# EAGLE design Arduino thermcouple (EAGLE 7.2.0)
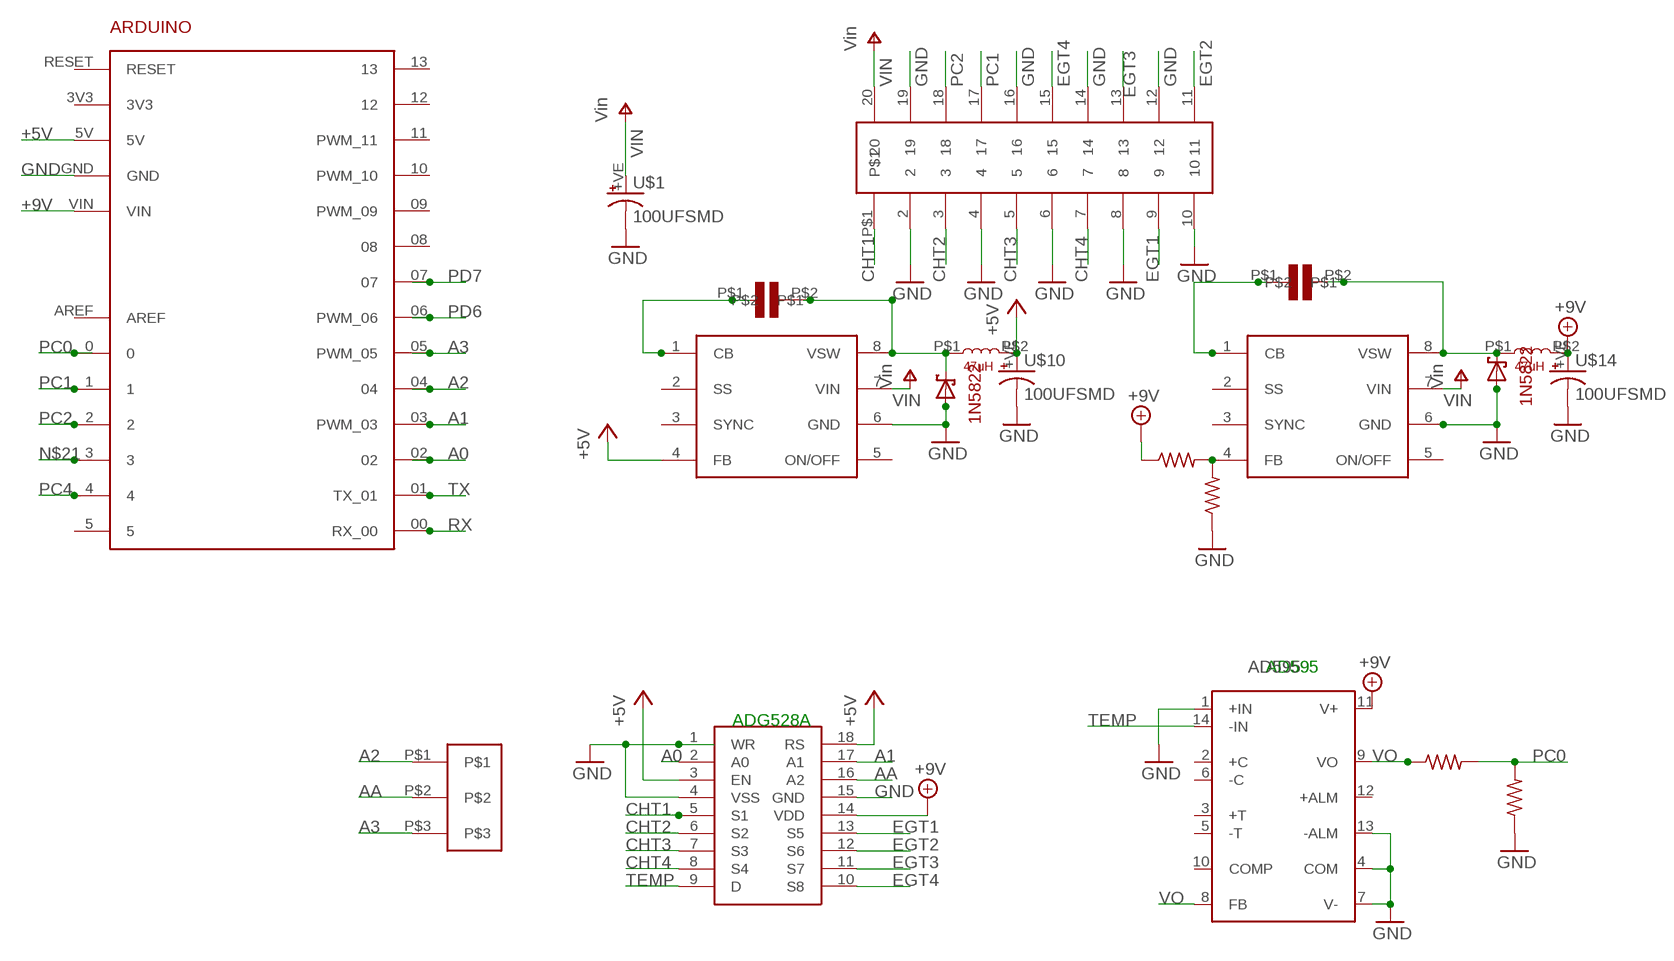
[diagram p0: schematic, sheet 1]

## Parts
"  ADG528A  [DIL18]
ARDUINO2  ARDUINO  [ARDUINO]
IC2  AD595  [DIL14]
R5  10K  0.3RESISTOR  [0.3RESISTOR]
R6  10K  0.3RESISTOR  [0.3RESISTOR]
U$1  100UFSMD  [100UFSMD]
U$2  1N5822  [1N5822]
U$3  LM2672  [DIL08]
U$4  1N5822  [1N5822]
U$5  01CAP  [01CAP]
U$6  LM2672  [DIL08]
U$7  01CAP  [01CAP]
U$8  20PIN0.1INCH  [20PIN0.1INCH]
U$9  47uH  47UHSMD  [47UHSMD]
U$10  100UFSMD  [100UFSMD]
U$13  47uH  47UHSMD  [47UHSMD]
U$14  100UFSMD  [100UFSMD]
U$15  1K5  0.3RESISTOR  [0.3RESISTOR]
U$16  10K  0.3RESISTOR  [0.3RESISTOR]
U$17  3PINHEADER  [3PINHEADER]

## Nets
+5V: ".3(EN) ".18(RS) ARDUINO2.5V U$3.4(FB) U$9.P$2 U$10.+VE(+)
+9V: ".14(VDD) ARDUINO2.VIN IC2.11(V+) U$13.P$2 U$14.+VE(+) U$16.P$1
A0: ".2(A0) ARDUINO2.02
A1: ".17(A1) ARDUINO2.03(PWM_03)
A2: ARDUINO2.04 U$17.P$1
A3: ARDUINO2.05(PWM_05) U$17.P$3
AA: ".16(A2) U$17.P$2
CHT1: ".5(S1) U$8.P$1
CHT2: ".6(S2) U$8.3
CHT3: ".7(S3) U$8.5
CHT4: ".8(S4) U$8.7
EGT1: ".13(S5) U$8.9
EGT2: ".12(S6) U$8.11
EGT3: ".11(S7) U$8.13
EGT4: ".10(S8) U$8.15
GND: ".1(WR) ".4(VSS) ".15(GND) ARDUINO2.GND IC2.1(+IN) IC2.4(COM) IC2.7(V-) IC2.13(-ALM) R6.P$1 U$1.-VE(-) U$2.A U$3.6(GND) U$4.A U$6.6(GND) U$8.2 U$8.4 U$8.6 U$8.8 U$8.10 U$8.12 U$8.14 U$8.16 U$8.19 U$10.-VE(-) U$14.-VE(-) U$15.P$1
N$1: U$6.1(CB) U$7.P$1
N$2: U$3.1(CB) U$5.P$1
N$5: U$2.K(C) U$3.8(VSW) U$5.P$2 U$9.P$1
N$7: U$6.4(FB) U$15.P$2 U$16.P$2
N$21: ARDUINO2.3
N$24: U$4.K(C) U$6.8(VSW) U$7.P$2 U$13.P$1
PC0: ARDUINO2.0 R5.P$2 R6.P$2
PC1: ARDUINO2.1 U$8.17
PC2: ARDUINO2.2 U$8.18
PC4: ARDUINO2.4
PD6: ARDUINO2.06(PWM_06)
PD7: ARDUINO2.07
RX: ARDUINO2.00(RX_00)
TEMP: ".9(D) IC2.14(-IN)
TX: ARDUINO2.01(TX_01)
VIN: U$1.+VE(+) U$3.7(VIN) U$6.7(VIN) U$8.20 ; supply symbol labelled V+
VO: IC2.8(FB) IC2.9(VO) R5.P$1
Unconnected: ARDUINO2.3V3 ARDUINO2.5 ARDUINO2.08 ARDUINO2.09(PWM_09) ARDUINO2.10(PWM_10) ARDUINO2.11(PWM_11) ARDUINO2.12 ARDUINO2.13 ARDUINO2.AREF ARDUINO2.RESET IC2.2(+C) IC2.3(+T) IC2.5(-T) IC2.6(-C) IC2.10(COMP) IC2.12(+ALM) U$3.2(SS) U$3.3(SYNC) U$3.5(ON/OFF) U$6.2(SS) U$6.3(SYNC) U$6.5(ON/OFF)

## Notes on the sheet
- AD595
- ADG528A

## Library data of the parts
" = 1components:ADG528A
ARDUINO2 = 1components:ARDUINO: For creating Arduino shields
IC2 = 1components:AD595: ANALOG DEVICES; MPN: AD595AQ; OC_FARNELL: 409194; OC_NEWARK: 06WX1596
R5 R6 U$15 U$16 = 1resistors:0.3RESISTOR
U$1 U$10 U$14 = 1components:100UFSMD
U$2 U$4 = 1components:1N5822
U$3 U$6 = 1components:LM2672
U$5 U$7 = 1components:01CAP
U$8 = 20pin0.1inch:20PIN0.1INCH
U$9 U$13 = 1components:47UHSMD
U$17 = 1components:3PINHEADER

## Board
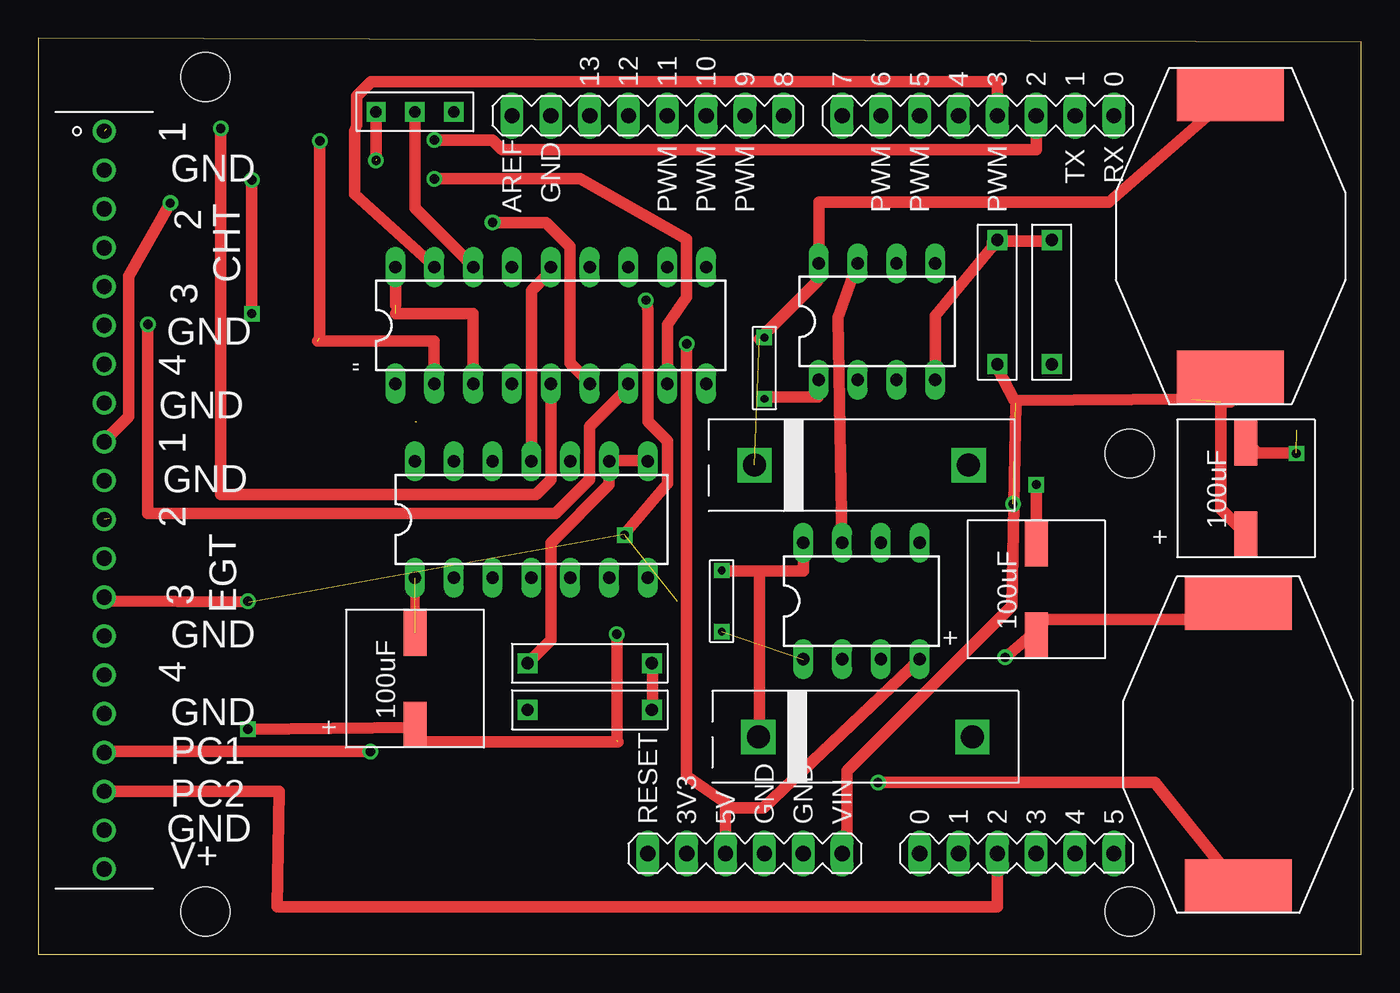
[diagram p1: board, top side]
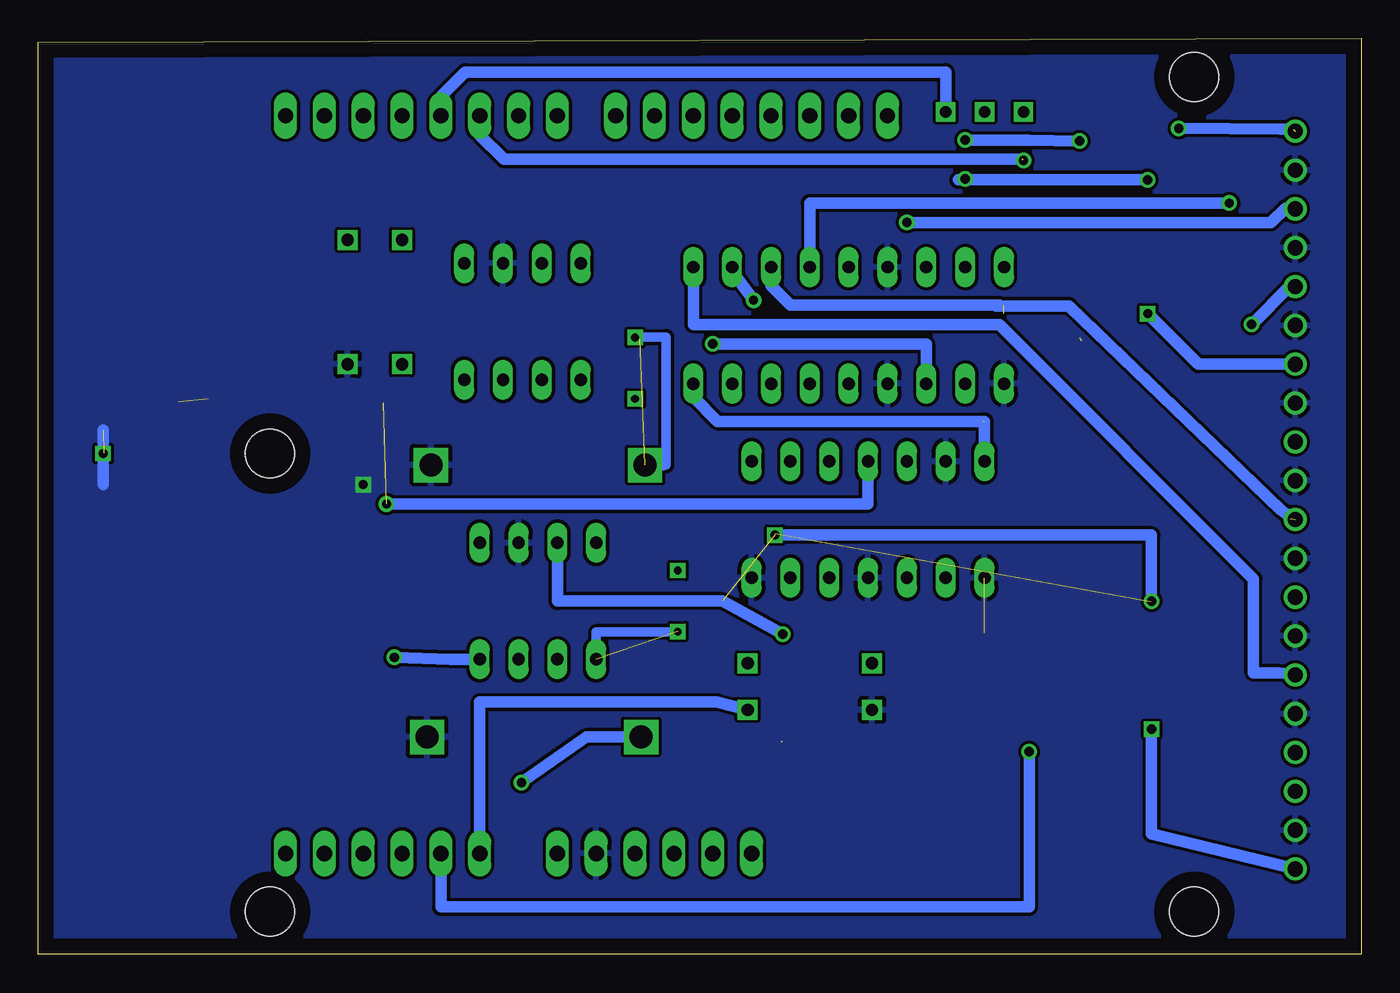
[diagram p2: board, bottom side, seen from below]

Size 86.54 x 59.93 mm. Coordinates in mm from the lower left corner, seen from the top.
Outline: 0,0 86.54,0 86.54,59.68 0,59.93 0,0
Copper layers (1*16): Top 0.035mm / dielectric 1.5mm / Bottom 0.035mm
Design rules "default *": minimum track width 30mil, minimum drill 24mil, track to track 8mil, track to pad 8mil, pad to pad 8mil, via to via 8mil, smd to smd 8mil, copper to edge 40mil, drill to drill 8mil, minimum pad ring 10mil, minimum via ring 8mil, stop-mask expansion 4mil, vias tented up to drill 0mil, thermal gap 10mil
Holes 3.2 mm at 10.92,57.4 10.92,2.79 71.37,2.79 71.37,32.77

### Footprints (pad centres in the part's own frame; a part is rotated, then mirrored left to right if it is on the bottom)
DIL18 = drill 0.813 long: 1 -10.16,-3.81; 2 -7.62,-3.81; 3 -5.08,-3.81; 4 -2.54,-3.81; 5 0,-3.81; 6 2.54,-3.81; 7 5.08,-3.81; 8 7.62,-3.81; 9 10.16,-3.81; 10 10.16,3.81; 11 7.62,3.81; 12 5.08,3.81; 13 2.54,3.81; 14 0,3.81; 15 -2.54,3.81; 16 -5.08,3.81; 17 -7.62,3.81; 18 -10.16,3.81
ARDUINO = drill 1 long: 00 25.4,-20.32; 0 -22.86,-7.62; 01 25.4,-17.78; 1 -22.86,-10.16; 02 25.4,-15.24; 2 -22.86,-12.7; 03 25.4,-12.7; 3 -22.86,-15.24; 3V3 -22.86,7.62; 04 25.4,-10.16; 4 -22.86,-17.78; 05 25.4,-7.62; 5 -22.86,-20.32; 5V -22.86,5.08; 06 25.4,-5.08; 07 25.4,-2.54; 08 25.4,1.27; 09 25.4,3.81; 10 25.4,6.35; 11 25.4,8.89; 12 25.4,11.43; 13 25.4,13.97; AREF 25.4,19.05; GND -22.86,0; GND2 -22.86,2.54; GND3 25.4,16.51; RESET -22.86,10.16; VIN -22.86,-2.54
DIL14 = drill 0.813 long: 1 -7.62,-3.81; 2 -5.08,-3.81; 3 -2.54,-3.81; 4 0,-3.81; 5 2.54,-3.81; 6 5.08,-3.81; 7 7.62,-3.81; 8 7.62,3.81; 9 5.08,3.81; 10 2.54,3.81; 11 0,3.81; 12 -2.54,3.81; 13 -5.08,3.81; 14 -7.62,3.81
0.3RESISTOR = drill 0.8 square: P$1 -4.064,0; P$2 4.064,0
100UFSMD = smd 1.5 x 3: +VE 0,3; -VE 0,-3
1N5822 = drill 1.5 square: A -7,0; K 7,0
DIL08 = drill 0.813 long: 1 -3.81,-3.81; 2 -1.27,-3.81; 3 1.27,-3.81; 4 3.81,-3.81; 5 3.81,3.81; 6 1.27,3.81; 7 -1.27,3.81; 8 -3.81,3.81
01CAP = drill 0.5 square: P$1 -2,0; P$2 2,0
20PIN0.1INCH = drill 1: 2 22.86,0; 3 20.32,0; 4 17.78,0; 5 15.24,0; 6 12.7,0; 7 10.16,0; 8 7.62,0; 9 5.08,0; 10 2.54,0; 11 0,0; 12 -2.54,0; 13 -5.08,0; 14 -7.62,0; 15 -10.16,0; 16 -12.7,0; 17 -15.24,0; 18 -17.78,0; 19 -20.32,0; 20 -22.86,0; P$1 25.4,0
47UHSMD = smd 3.5 x 7: P$1 -9.25,0; P$2 9.25,0
3PINHEADER = drill 0.75 square: P$1 -2.54,0; P$2 0,0; P$3 2.54,0

### Placement (x,y rotation side)
"  33.53,41.15 0 top
ARDUINO2  50.04,29.46 90 top
IC2  32.26,28.45 0 top
R5  36.07,19.05 0 top
R6  36.07,16 0 top
U$1  24.64,18.03 180 top
U$2  54.1,14.22 180 top
U$3  53.85,23.11 0 top
U$4  53.85,32 180 top
U$5  44.7,23.11 90 top
U$6  54.86,41.4 0 top
U$7  47.5,38.35 90 top
U$8  4.32,28.45 90 top
U$9  78.49,13.72 90 top
U$10  65.28,23.88 180 top
U$13  77.98,46.99 270 top
U$14  78.99,30.48 180 top
U$15  66.29,42.67 90 top
U$16  62.74,42.67 90 top
U$17  24.64,55.12 180 top

### Tracks (layer width: path | path; a pad name or v marks a point on that pad's centre or on a via)
+5V  (via drill 0.61)  (1 unrouted)
  Top 0.762: U$9.P$2 78.3,22.8 78.3,21.91 65.28,21.91 U$10.+VE 64.96,20.89 v63.25,19.43 | ".18 23.37,42.48 | U$3.4 47.43,9.59 44.96,9.59 | ARDUINO2.5V 44.96,9.59 | v42.42,39.94 42.42,11.68 44.96,9.91 44.96,9.59 | ".3 28.45,41.91 23.37,41.91
  Bottom 0.762: ".3 28.45,39.94 v42.42,39.94 | v63.25,19.43 59.56,19.3 U$3.4
+9V  (via drill 0.61)  (2 unrouted)
  Top 0.762: IC2.11 32.26,43.43 33.53,44.7 ".14 | 63.85,36.23 62.74,38.35 U$16.P$1 | U$13.P$2 77.98,36.13 77.34,36.13 77.34,29.15 78.93,27.56 U$14.+VE | ARDUINO2.VIN 52.9,6.92 52.9,12 63.69,22.8 63.95,36.07 63.85,36.23 | 63.85,36.23 75.44,36.32
  Bottom 0.762: IC2.11 32.26,29.46 v63.75,29.46 63.69,29.46
A0  (via drill 0.61)  (1 unrouted)
  Top 0.762: v18.41,53.21 18.41,40.32 | v25.91,53.28 29.72,53.28 30.35,52.64 65.28,52.64 ARDUINO2.02 | ".2 25.91,37.4 25.91,40.13 18.29,40.13
  Bottom 0.762: v18.41,53.21 21.78,53.28 v25.91,53.28
A1
  Top 0.762: ARDUINO2.03 62.74,57.09 21.78,57.09 20.83,56.13 20.83,54.23 20.7,53.85 20.7,49.72 25.91,45.02 ".17
A2
  Bottom 0.762: U$17.P$1 27.18,57.72 58.61,57.72 60.2,56.13 ARDUINO2.04
A3  (via drill 0.61)  (1 unrouted)
  Top 0.762: v22.1,51.94 U$17.P$3
  Bottom 0.762: 22.16,52.01 56.07,52.01 57.66,53.59 ARDUINO2.05
AA
  Top 0.762: U$17.P$2 24.64,48.83 28.45,45.02 ".16
CHT1  (via drill 0.61)  (1 unrouted)
  Top 0.762: ".5 33.53,31.05 32.58,30.1 11.94,30.1 v11.94,54.04
  Bottom 0.762: v11.94,54.04 5.27,53.98 4.44,53.98
CHT2  (via drill 0.61)
  Top 0.762: v29.72,47.88 33.21,47.88 34.8,46.29 34.8,38.67 36.07,37.4 ".6
  Bottom 0.762: v29.72,47.88 5.9,47.88 4.95,48.83 4.32,48.83 U$8.3
CHT3  (via drill 0.61)
  Top 0.762: v7.17,41.21 7.17,28.83 33.84,28.83 36.07,31.05 36.07,34.54 38.61,37.08 ".7
  Bottom 0.762: v7.17,41.21 4.64,43.75 4.32,43.75 U$8.5
CHT4  (via drill 0.61)  (1 unrouted)
  Top 0.762: ".8 41.15,41.21 42.42,42.99 42.42,46.8 35.43,50.74 v25.91,50.74 | 4.32,38.67 U$8.7 | 13.97,50.8 v13.97,50.67 13.97,41.91
  Bottom 0.762: v25.91,50.74 26.35,50.67 v13.97,50.67 | U$8.7 10.67,38.61 13.97,41.91
EGT1  (via drill 0.61)
  Top 0.762: v8.64,49.15 5.9,44.39 5.9,35.18 4.32,33.59 U$8.9
  Bottom 0.762: ".13 36.07,49.15 v8.64,49.15
EGT2  (1 unrouted)
  Bottom 0.762: ".12 38.61,43.75 37.34,42.48 23.69,42.48 23.88,42.42 19.11,42.42 5.27,29.08 4.95,28.83 4.64,28.51
EGT3  (via drill 0.61)  (1 unrouted)
  Top 0.762: v39.75,42.8 39.88,42.16 39.88,34.86 41.15,33.59 41.15,30.8 38.35,27.5 | 13.78,23.05 4.32,23.11 U$8.13
  Bottom 0.762: v39.75,42.8 41.15,44.7 ".11
EGT4
  Bottom 0.762: ".10 43.69,41.21 23.69,41.21 7.05,24.57 7.05,18.41 5.46,18.41 4.64,18.35 4.32,18.35 U$8.15
GND  (via drill 0.6)  (2 unrouted)
  Top 0.406: 82.26,32.8 82.3,32.77
  Top 0.762: 65.28,26.61 U$10.-VE v65.28,30.73 | U$14.-VE 79.25,33.27 79.72,32.8 82.26,32.8
  Bottom 0.762: 82.3,34.29 82.3,30.73
  pour Bottom: 0.25,60.2 86.87,59.94 87.12,-0.25 0.25,-0.25
N$1
  Top 0.762: U$7.P$1 47.5,36.45 50.99,36.45 50.99,37.4 U$6.1
N$2  (1 unrouted)
N$3  (via drill 0.6)
  other vias: 82.3,32.77
N$5  (via drill 0.61)
  Top 0.762: 47.18,25.08 50.04,25.08 U$3.8 | 47.18,25.08 44.96,25.08 U$5.P$2 | 47.18,25.08 47.18,14.22 U$2.K | v54.93,11.24 73.02,11.24 78.3,4.7 U$9.P$1
  Bottom 0.762: v54.93,11.24 50.67,14.22 U$2.K
N$7
  Top 0.762: 62.74,46.93 U$16.P$2 | U$16.P$2 62.8,46.67 65.98,46.67 U$15.P$2 | 58.67,37.47 U$6.4 58.67,41.78 62.42,46.29 62.42,46.61 U$16.P$2
N$8
  Bottom 0.635: 44.7,21.08 50.04,21.08 50.04,19.05
N$9  (via drill 0.6)
  other vias: 38.35,27.43
N$10  (via drill 0.6)
  other vias: 13.97,41.91
N$14
  Top 0.635: 24.64,24.64 24.64,20.57
N$24  (1 unrouted)
  Top 0.762: 47.18,40.26 U$7.P$2 47.5,40.58 50.99,44.07 50.99,45.02 U$6.8 51.05,49.21 70.04,49.21 77.98,56.13 U$13.P$1
  Bottom 0.762: U$4.K 45.72,32
N$25
  Bottom 0.635: 47.5,40.39 45.47,40.39 45.47,32
PC0
  Top 0.762: R6.P$2 40.2,16.13 40.2,18.99 R5.P$2
  Bottom 0.762: ARDUINO2.0 57.66,16.51 42.16,16.51 R6.P$2
PC1  (via drill 0.61)
  Top 0.762: v21.72,13.27 4.32,13.27 U$8.17
  Bottom 0.762: v21.72,13.27 21.72,3.11 60.2,3.11 ARDUINO2.1
PC2
  Top 0.762: ARDUINO2.2 62.74,3.11 15.62,3.11 15.75,10.67 U$8.18
TEMP  (1 unrouted)
  Bottom 0.762: 24.64,34.86 IC2.14 | 24.77,34.86 42.1,34.86 43.69,36.45 ".9
VIN  (via drill 0.6, 0.61)  (2 unrouted)
  Top 0.762: 37.91,13.91 24.77,13.91 U$1.+VE 24.64,14.86 v13.72,14.73 | U$3.7 52.32,41.66 U$6.7 | v37.85,20.95 37.85,13.97
  Bottom 0.762: U$3.7 52.58,23.11 41.78,23.11 v37.85,20.95 | v13.72,23.11 13.72,27.43 38.35,27.43 | v13.72,14.73 13.72,7.87 U$8.20
VO
  Top 0.762: R5.P$1 33.53,20.57 33.53,26.92 37.34,30.73 IC2.9 37.66,32.32 39.88,32.32 IC2.8

### Text on the board
tPlace: 1 | GND | 2 | 3 | CHT | GND | 4 | GND | 1 | GND | 2 | 3 | EGT | GND | 4 | GND | PC1 | PC2 | GND | V+